# EAGLE design NoteTaker (EAGLE 7.2.0)
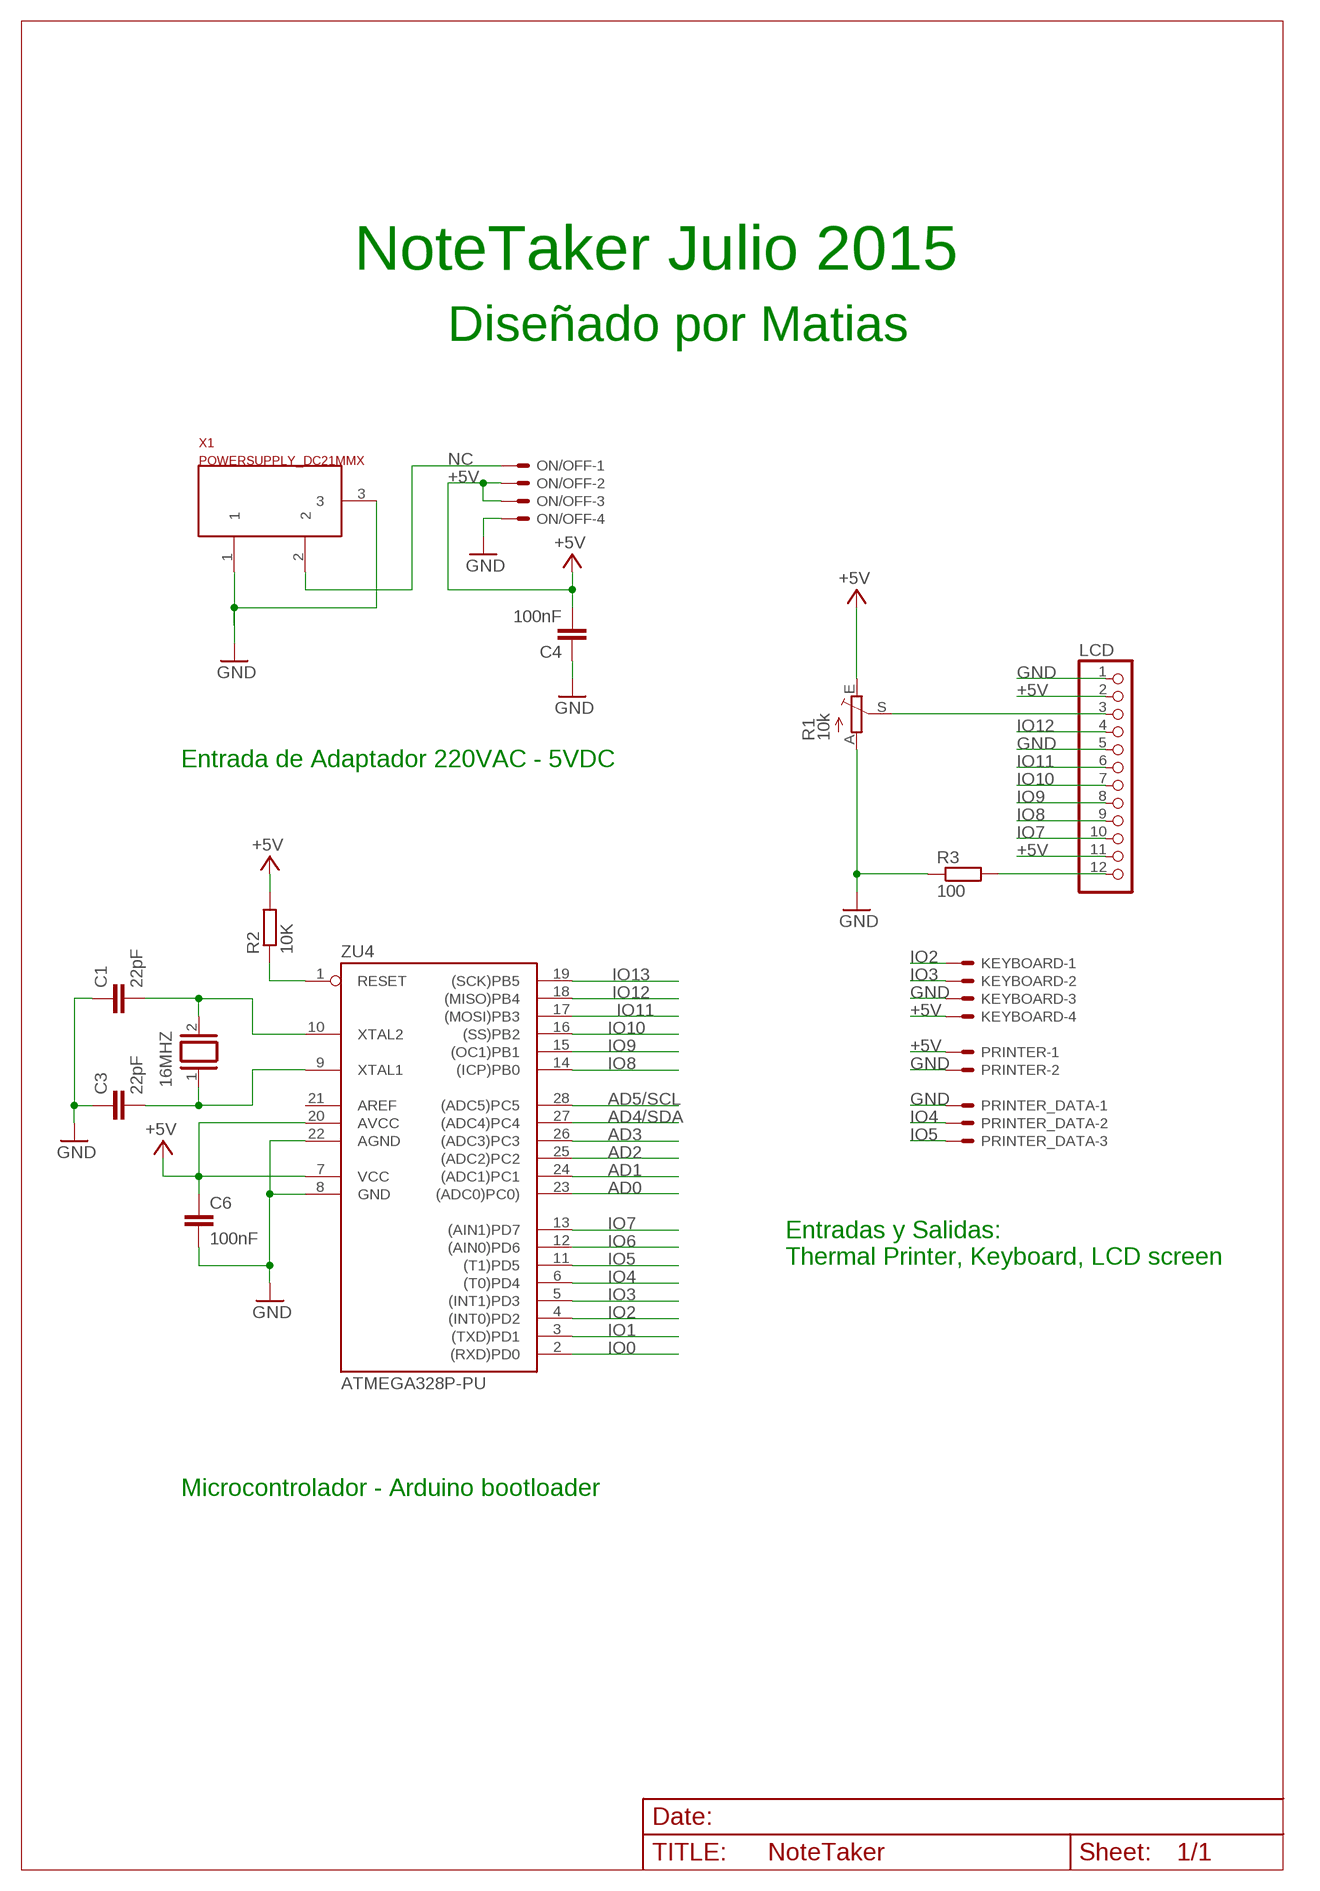
[diagram p0: schematic, sheet 1]

## Parts
16MHZ  XTAL/S  [QS]
C1  22pF  C-EU025-025X050  [C025-025X050]
C3  22pF  C-EU025-025X050  [C025-025X050]
C4  100nF  C-EU025-025X050  [C025-025X050]
C6  100nF  C-EU025-025X050  [C025-025X050]
KEYBOARD  KK-156-4  [KK-156-4]
LCD  PINHD-1X12  [1X12]
ON/OFF  KK-156-4  [KK-156-4]
PRINTER  KK-156-2  [KK-156-2]
PRINTER_DATA  KK-156-3  [KK-156-3]
R1  10k  TRIM_EU-S64W  [S64W]
R2  10K  R-EU_0207/10  [0207/10]
R3  100  R-EU_0207/10  [0207/10]
X1  POWERSUPPLY_DC21MMX  [POWERSUPPLY_DC-21MM]
ZU4  ATMEGA328P-PU  [DIL28-3]

## Nets
+5V [usbvcc]: C4.2 C6.1 KEYBOARD.4 LCD.2 LCD.11 ON/OFF.2 ON/OFF.3 PRINTER.1 R1.E R2.2 ZU4.7(VCC) ZU4.20(AVCC)
AD0: ZU4.23((ADC0)PC0))
AD1: ZU4.24((ADC1)PC1)
AD2: ZU4.25((ADC2)PC2)
AD3: ZU4.26((ADC3)PC3)
AD4/SDA: ZU4.27((ADC4)PC4)
AD5/SCL: ZU4.28((ADC5)PC5)
GND [gnd]: C1.1 C3.1 C4.1 C6.2 KEYBOARD.3 LCD.1 LCD.5 ON/OFF.4 PRINTER.2 PRINTER_DATA.1 R1.A R3.1 X1.1 X1.3 ZU4.8(GND) ZU4.22(AGND)
IO0: ZU4.2((RXD)PD0)
IO1: ZU4.3((TXD)PD1)
IO2: KEYBOARD.1 ZU4.4((INT0)PD2)
IO3: KEYBOARD.2 ZU4.5((INT1)PD3)
IO4: PRINTER_DATA.2 ZU4.6((T0)PD4)
IO5: PRINTER_DATA.3 ZU4.11((T1)PD5)
IO6: ZU4.12((AIN0)PD6)
IO7: LCD.10 ZU4.13((AIN1)PD7)
IO8: LCD.9 ZU4.14((ICP)PB0)
IO9: LCD.8 ZU4.15((OC1)PB1)
IO10: LCD.7 ZU4.16((SS)PB2)
IO11: LCD.6 ZU4.17((MOSI)PB3)
IO12: LCD.4 ZU4.18((MISO)PB4)
IO13: ZU4.19((SCK)PB5)
N$1: 16MHZ.1 C3.2 ZU4.9(XTAL1)
N$2: LCD.3 R1.S
N$3: R2.1 ZU4.1(RESET)
N$15: LCD.12 R3.2
NC [usbvcc]: ON/OFF.1 X1.2
XTAL2: 16MHZ.2 C1.2 ZU4.10(XTAL2)
Unconnected: ZU4.21(AREF)

## Notes on the sheet
- NoteTaker Julio 2015
- Diseñado por Matias
- Entrada de Adaptador 220VAC - 5VDC
- Entradas y Salidas: 
  Thermal Printer, Keyboard, LCD screen
- Microcontrolador - Arduino bootloader

## Library data of the parts
16MHZ = special:XTAL/S: CRYSTAL
C1 C3 C4 C6 = rcl:C-EU: CAPACITOR, European symbol
KEYBOARD ON/OFF = con-molex:KK-156-4: KK 156 HEADER Source: http://www.molex.com/pdm_docs/sd/026604100_sd.pdf; OC_FARNELL: unknown; OC_NEWARK: unknown
LCD = pinhead:PINHD-1X12: PIN HEADER
PRINTER = con-molex:KK-156-2: KK 156 HEADER Source: http://www.molex.com/pdm_docs/sd/026604100_sd.pdf; OC_FARNELL: unknown; OC_NEWARK: unknown
PRINTER_DATA = con-molex:KK-156-3: KK 156 HEADER Source: http://www.molex.com/pdm_docs/sd/026604100_sd.pdf; OC_FARNELL: unknown; OC_NEWARK: unknown
R1 = pot:TRIM_EU-: POTENTIOMETER
R2 R3 = rcl:R-EU_: RESISTOR, European symbol
X1 = SmartPrj:POWERSUPPLY_DC21MM
ZU4 = SmartPrj:ATMEGA328P-: MICROCONTROLLER 4 Kbytes FLASH 128 bytes SRAM 256 bytes EEPROM UART 6-channel 10 bit ADC

## Net classes
0 default: width 0.254 mm, clearance 0.254 mm
1 power: width 0.61 mm, drill 0.61 mm, clearance 0.254 mm
2 gnd: width 0.305 mm, drill 0.559 mm, clearance 0.254 mm
3 usbvcc: width 0.508 mm, drill 0.61 mm, clearance 0.254 mm
4 aref: width 0.406 mm, drill 0.61 mm, clearance 0.254 mm

## Board
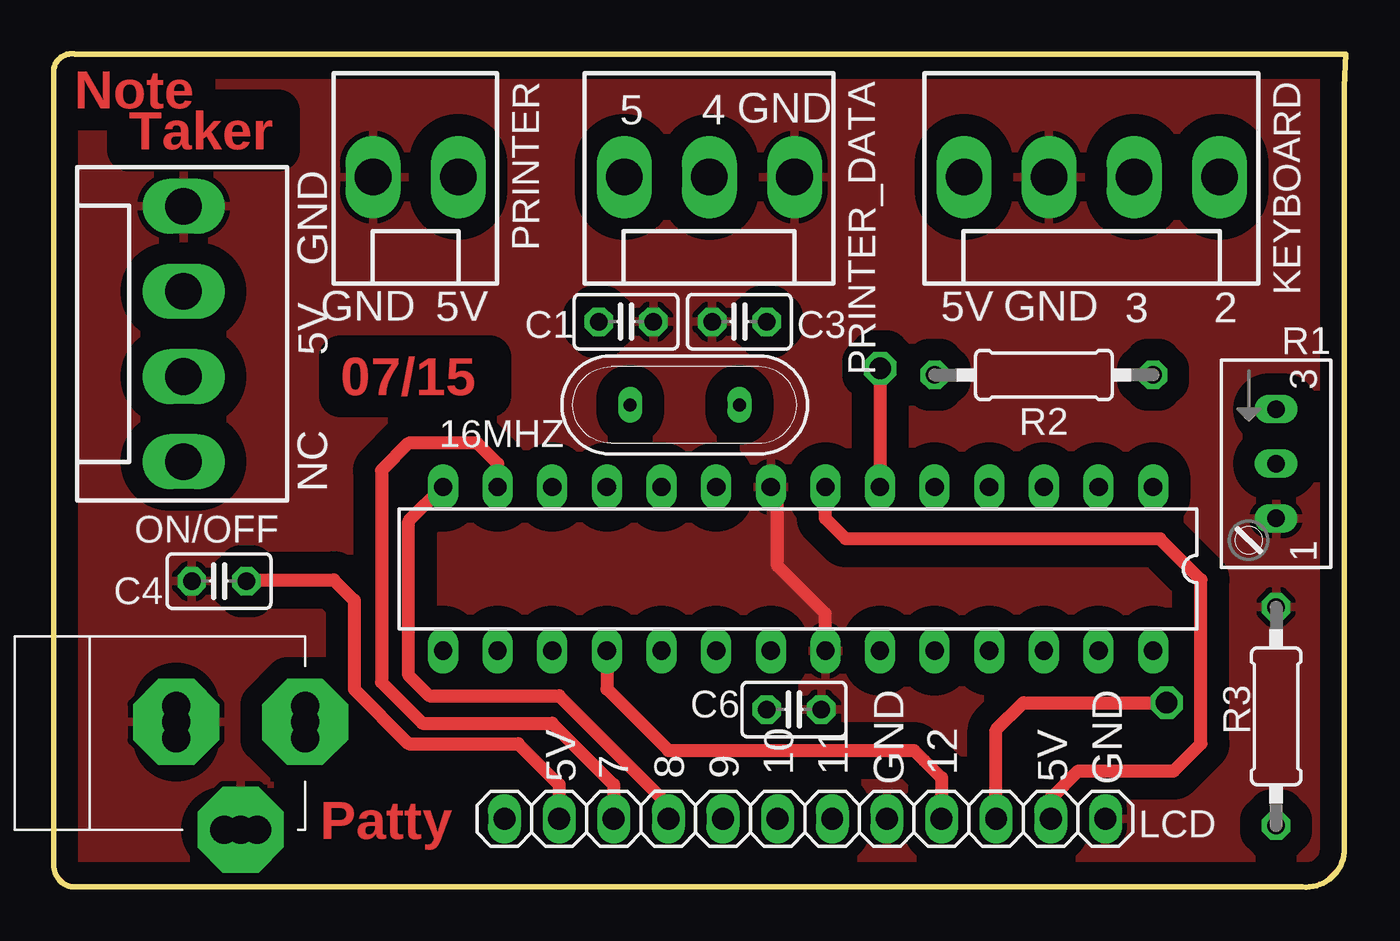
[diagram p1: board, top side]
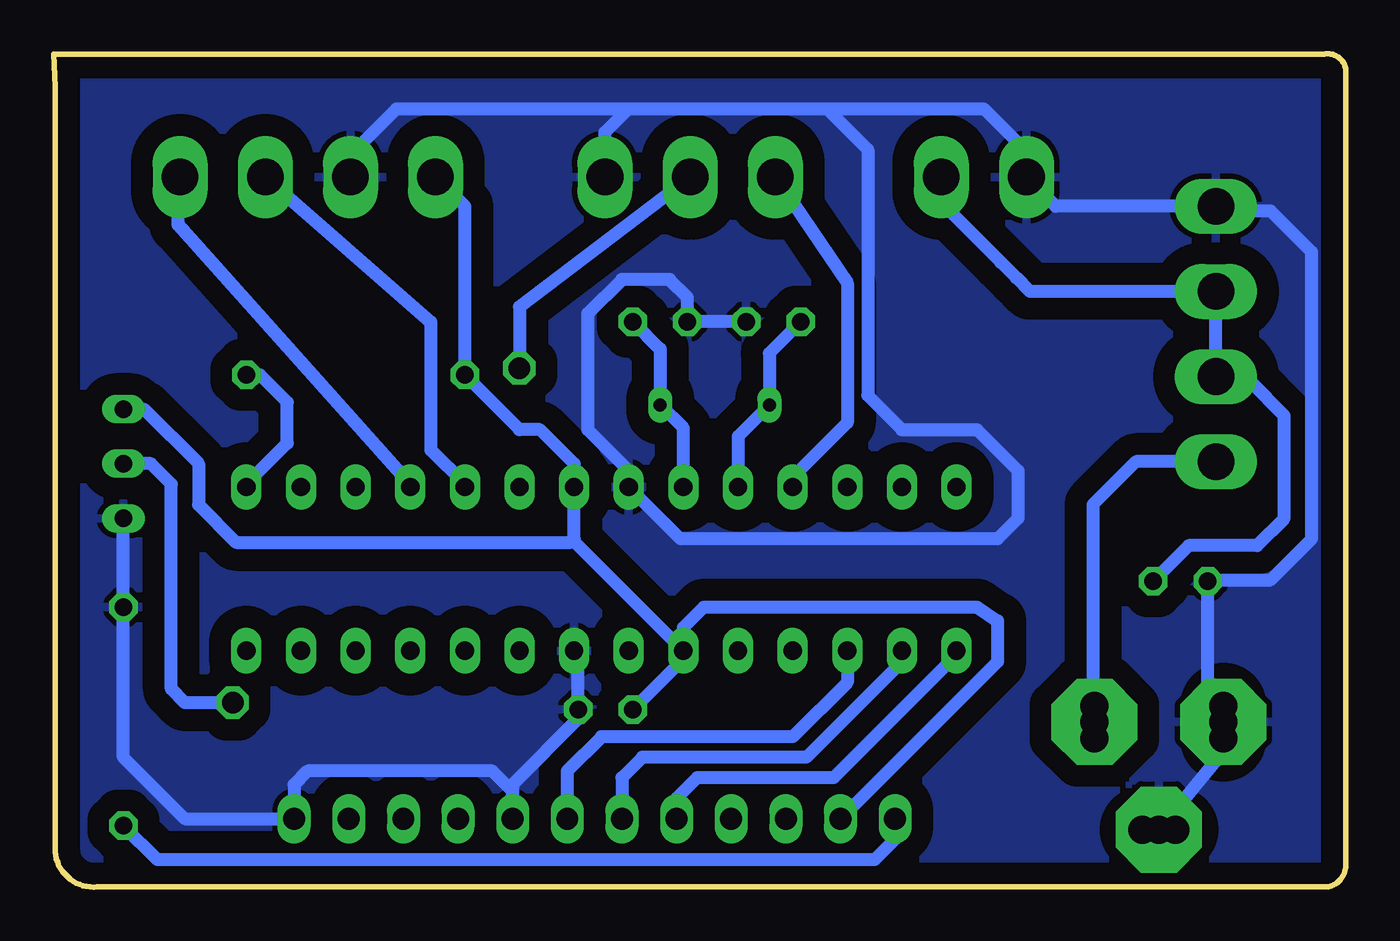
[diagram p2: board, bottom side, seen from below]

Size 60.07 x 38.76 mm. Coordinates in mm from the lower left corner, seen from the top.
Outline: 60.07,38.74 60.01,37.22 60.01,1.64 arc-90 58.05,0.01 1,0.01 arc-90 0,1.01 0,38.06 arc-90 1,38.74 60.07,38.74
Copper layers (1*16): Top 0.035mm / dielectric 1.5mm / Bottom 0.035mm
Design rules "default *": minimum track width 40mil, minimum drill 40mil, track to track 40mil, track to pad 40mil, pad to pad 40mil, via to via 40mil, smd to smd 8mil, copper to edge 40mil, drill to drill 40mil, minimum pad ring 10mil, minimum via ring 10mil, stop-mask expansion 1mil, vias tented up to drill 30mil, thermal gap 10mil
vRestrict: area 22.9,44.1 to 24.6,49.2; area 25.4,45.5 to 27.1,49.2; area 28.4,45.3 to 29.6,48.8; area 31,45.3 to 32.1,48.8; area 33.5,45.3 to 34.7,48.8; area 36.1,45.3 to 37.2,48.8; area 38.7,47.3 to 39.9,48.8; area 40.3,45.1 to 47.6,46.9; area 60.3,44.2 to 61.7,46.7; area 62.9,44.2 to 64.3,46.7; area 61.3,35.8 to 64.8,37.2; area 0.6,21.9 to 2,30.1; 14 more areas

### Footprints (pad centres in the part's own frame; a part is rotated, then mirrored left to right if it is on the bottom)
QS = drill 0.61 long: 1 -2.54,0; 2 2.54,0
C025-025X050 = drill 0.813 octagon: 1 -1.27,0; 2 1.27,0
KK-156-4 = drill 1.7 pad 2.184 long: 1 -5.94,0; 2 -1.98,0; 3 1.98,0; 4 5.94,0
1X12 = drill 1.016 long: 1 -13.97,0; 2 -11.43,0; 3 -8.89,0; 4 -6.35,0; 5 -3.81,0; 6 -1.27,0; 7 1.27,0; 8 3.81,0; 9 6.35,0; 10 8.89,0; 11 11.43,0; 12 13.97,0
KK-156-2 = drill 1.7 pad 2.184 long: 1 -1.98,0; 2 1.98,0
KK-156-3 = drill 1.7 pad 2.184 long: 1 -3.96,0; 2 0,0; 3 3.96,0
S64W = drill 0.813 long: A 2.54,1.27; E -2.54,1.27; S 0,1.27
0207/10 = drill 0.813 octagon: 1 -5.08,0; 2 5.08,0
POWERSUPPLY_DC-21MM = drill 1.3 pad 4 octagon: 1 -5.08,-3.353; 2 -0.076,-6.35; 3 -0.076,-0.356 | drill 1.3: 4 -5.08,-4.115; 5 -5.08,-2.591; 6 -0.838,-0.356; 7 0.686,-0.356; 8 -0.838,-6.35; 9 0.686,-6.35
DIL28-3 = drill 0.85 pad 1.422 long: 1 -16.51,-3.81; 2 -13.97,-3.81; 3 -11.43,-3.81; 4 -8.89,-3.81; 5 -6.35,-3.81; 6 -3.81,-3.81; 7 -1.27,-3.81; 8 1.27,-3.81; 9 3.81,-3.81; 10 6.35,-3.81; 11 8.89,-3.81; 12 11.43,-3.81; 13 13.97,-3.81; 14 16.51,-3.81; 15 16.51,3.81; 16 13.97,3.81; 17 11.43,3.81; 18 8.89,3.81; 19 6.35,3.81; 20 3.81,3.81; 21 1.27,3.81; 22 -1.27,3.81; 23 -3.81,3.81; 24 -6.35,3.81; 25 -8.89,3.81; 26 -11.43,3.81; 27 -13.97,3.81; 28 -16.51,3.81

### Placement (x,y rotation side)
16MHZ  29.34,22.42 180 top
C1  26.61,26.3 180 top
C3  31.88,26.3 0 top
C4  7.68,14.23 0 top
C6  34.42,8.26 0 top
KEYBOARD  48.26,33.03 180 top
LCD  34.92,3.18 180 top
ON/OFF  6.03,25.72 90 top
PRINTER  16.83,33.03 180 top
PRINTER_DATA  30.48,33.03 180 top
R1  55.56,19.69 270 top
R2  46.04,23.82 180 top
R3  56.83,7.94 270 top
X1  5.33,7.75 90 top
ZU4  34.61,14.8 180 top

### Tracks (layer width: path | path; a pad name or v marks a point on that pad's centre or on a via)
+5V
  Top 0.61: C4.2 9.02,14.29 13.02,14.29 13.97,13.34 13.97,9.21 16.51,6.67 21.59,6.67 23.5,4.77 LCD.11 | LCD.2 46.35,4.13 47.62,5.4 52.07,5.4 53.34,6.67 53.34,14.29 51.44,16.2 36.83,16.2 35.88,17.15 ZU4.7
  Bottom 0.61: ZU4.20 35.88,16.07 35.88,16.2 | 35.88,16.2 ZU4.7 35.88,19.69 37.47,21.28 38.42,21.28 R2.2 40.96,31.66 KEYBOARD.4 | PRINTER.1 18.73,32.95 18.73,31.76 16.03,29.06 15.31,28.34 14.68,27.7 ON/OFF.3 ON/OFF.2 | ON/OFF.2 6.11,24.38 | 8.89,14.29 C4.2 7.3,15.88 4.13,15.88 2.86,17.15 2.86,21.91 4.45,23.5 5.79,23.5 ON/OFF.2 | ZU4.20 30.8,10.61 C6.1 | ZU4.20 30.8,12.07 29.84,13.02 17.14,13.02 16.19,12.39 16.19,10.48 LCD.11 | 35.88,16.2 36.04,16.04 51.59,16.04 53.34,17.79 53.34,19.69 55.88,22.23 R1.E
GND
  Top 0.61: ZU4.22 35.88,12.71 33.66,14.93 33.66,18.29 ZU4.8
  Bottom 0.61: X1.1 5.69,6.31 X1.3 6.41,9.04 C4.1 6.35,14.29 3.49,14.29 1.59,16.2 1.59,29.53 3.49,31.44 5.81,31.44 ON/OFF.4 13.48,31.66 PRINTER.2 | C1.1 C3.1 30.61,27.44 31.43,28.26 33.66,28.26 35.24,26.68 35.24,21.28 33.34,19.37 ZU4.8 30.92,16.2 16.19,16.2 15.24,17.15 15.24,19.37 17.14,21.28 20.64,21.28 22.23,22.87 22.23,34.3 24.13,36.2 | 14.12,32.3 PRINTER.2 | ZU4.22 35.69,10.8 C6.2 35.69,7.82 38.73,4.77 LCD.5 38.73,4.45 39.69,5.4 48.26,5.4 48.9,4.77 LCD.1 53.98,3.18 56.83,6.04 R3.1 R1.A | KEYBOARD.3 46.28,34.05 44.13,36.2 33.34,36.2 | 24.13,36.2 16.83,36.2 14.92,34.3 14.92,33.1 PRINTER.2 | PRINTER_DATA.1 34.44,35.1 33.34,36.2 | 33.34,36.2 24.13,36.2
  pour Bottom: 0.32,37.15 0.32,37.79 0.95,38.42 58.74,38.42 59.69,37.47 59.69,1.59 58.42,0.32 0.95,0.32 0.32,0.96
  pour Top: 0.64,38.42 59.37,38.42 59.69,38.11 59.69,1.59 58.42,0.32 1.27,0.32 0.32,1.28 0.32,38.11
IO2
  Bottom 0.61: ZU4.4 43.5,18.74 54.29,30.8 54.29,32.93 KEYBOARD.1
IO3
  Bottom 0.61: KEYBOARD.2 42.55,26.28 42.55,20.33 40.96,18.74 ZU4.5
IO4  (via drill 1)
  Top 0.61: v38.42,24.14 ZU4.6
  Bottom 0.61: PRINTER_DATA.2 38.42,26.99 v38.42,24.14
IO5
  Bottom 0.61: PRINTER_DATA.3 23.18,28.1 23.18,21.6 25.72,19.06 ZU4.11
IO7
  Top 0.61: ZU4.13 20.64,19.69 19.68,20.64 16.51,20.64 15.24,19.37 15.24,9.53 17.14,7.63 23.18,7.63 26.04,4.77 LCD.10
IO8
  Top 0.61: ZU4.14 16.51,17.02 16.51,9.85 17.46,8.9 23.5,8.9 28.57,3.82 LCD.9
IO9
  Bottom 0.61: ZU4.15 18.1,10.8 23.81,5.09 30.16,5.09 31.11,4.13 LCD.8
IO10
  Bottom 0.61: ZU4.16 20.64,10.48 25.08,6.04 32.7,6.04 33.66,5.09 LCD.7
IO11
  Bottom 0.61: ZU4.17 23.18,9.53 25.72,6.99 34.61,6.99 36.2,5.4 LCD.6
IO12
  Top 0.61: LCD.4 41.27,5.09 40.48,5.88 40.01,6.36 28.57,6.36 25.72,9.21 ZU4.18
N$1
  Bottom 0.61: ZU4.9 30.8,21.34 16MHZ.1 31.88,25.03 C3.2
N$2  (via drill 1)
  Top 0.61: LCD.3 43.81,7.31 45.09,8.58 v51.75,8.58
  Bottom 0.61: v51.75,8.58 53.98,8.58 54.61,9.21 54.61,18.74 55.56,19.69 R1.S
N$3
  Bottom 0.61: ZU4.1 51.12,18.74 49.21,20.64 49.21,22.55 50.48,23.82 R2.1
N$15
  Bottom 0.61: LCD.12 20.95,2.23 21.91,1.28 55.24,1.28 R3.2
NC
  Bottom 0.61: X1.2 11.75,8.38 11.75,17.79 9.75,19.78 ON/OFF.1
XTAL2
  Bottom 0.61: ZU4.10 28.26,20.96 16MHZ.2 26.8,24.83 C1.2

### Text on the board
Top: Note | Taker | 07/15 | Patty
tPlace: 5 | 4 | 3 | 2 | 10 | 11 | 12 | 7 | 8 | 9
tNames: GND | GND | GND | 5V | 5V | GND | 5V | NC | 5V | GND | 5V | GND
ReferenceLC: L | TX | ON | RX | PC1 | PC2
214bmp: D:/SmartProjects/Snc/a4_bn_logo2.bmp